# EAGLE schematic rpi_orchids (EAGLE 7.2.0)
A shield for Raspberry pi 3 B: Orchid farm
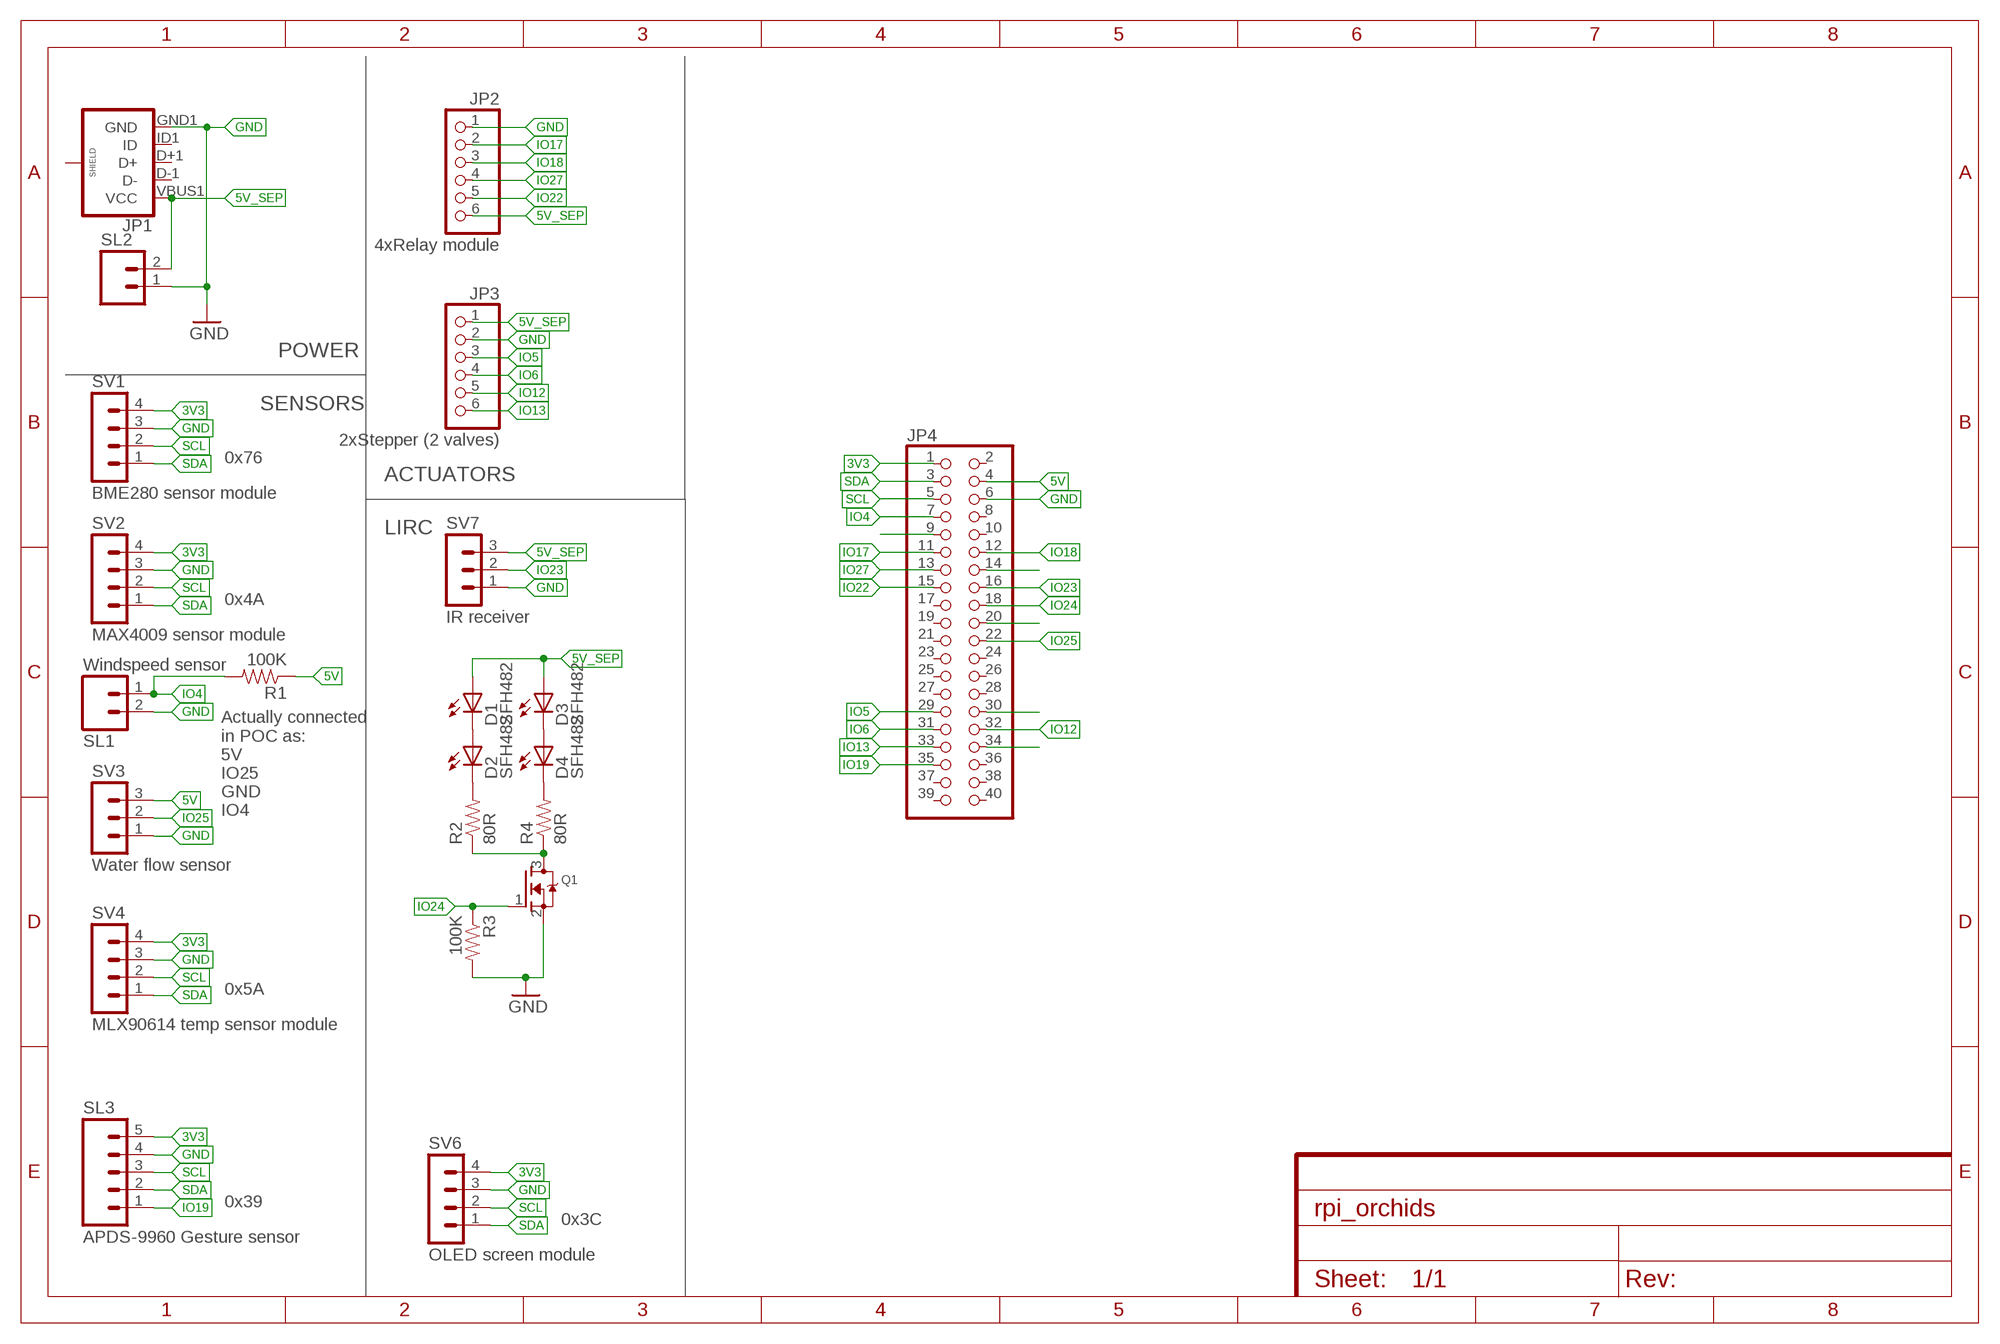
[diagram p0: schematic, sheet 1]

## Parts
D1  SFH482  [SFH482]
D2  SFH482  [SFH482]
D3  SFH482  [SFH482]
D4  SFH482  [SFH482]
JP1  USB_MICROB_PLUGCONN-11752  [USB-B-MICRO-SMD_V03]
JP2  4xRelay module  PINHD-1X6  [1X06]
JP3  2xStepper (2 valves)  PINHD-1X6  [1X06]
JP4  PINHD-2X20  [2X20]
Q1  MOSFET-NREFLOW  [SOT23]
R1  100K  RESISTOR0603  [0603-RES]
R2  80R  RESISTOR0603  [0603-RES]
R3  100K  RESISTOR0603  [0603-RES]
R4  80R  RESISTOR0603  [0603-RES]
SL1  Windspeed sensor  MA02  [02PA]
SL2  MA02  [02PA]
SL3  APDS-9960 Gesture sensor  MA05  [05PA]
SV1  BME280 sensor module  MA04-1  [MA04-1]
SV2  MAX4009 sensor module  MA04-1  [MA04-1]
SV3  Water flow sensor  MA03-1  [MA03-1]
SV4  MLX90614 temp sensor module  MA04-1  [MA04-1]
SV6  OLED screen module  MA04-1  [MA04-1]
SV7  IR receiver  MA03-1  [MA03-1]

## Nets
3V3: JP4.1 SL3.5 SV1.4 SV2.4 SV4.4 SV6.4
5V: JP4.4 R1.1 SV3.3
5V_SEP: D1.A D3.A JP1.VBUS1(VCC) JP2.6 JP3.1 SL2.2 SV7.3
GND: JP1.GND1(GND) JP2.1 JP3.2 JP4.6 Q1.2(S) R3.2 SL1.2 SL2.1 SL3.4 SV1.3 SV2.3 SV3.1 SV4.3 SV6.3 SV7.1
IO4: JP4.7 R1.2 SL1.1
IO5: JP3.3 JP4.29
IO6: JP3.4 JP4.31
IO12: JP3.5 JP4.32
IO13: JP3.6 JP4.33
IO17: JP2.2 JP4.11
IO18: JP2.3 JP4.12
IO19: JP4.35 SL3.1
IO22: JP2.5 JP4.15
IO23: JP4.16 SV7.2
IO24: JP4.18 Q1.1(G) R3.1
IO25: JP4.22 SV3.2
IO27: JP2.4 JP4.13
N$1: D3.K(C) D4.A
N$2: D1.K(C) D2.A
N$3: JP4.30
N$4: D2.K(C) R2.2
N$5: D4.K(C) R4.2
N$6: JP4.34
N$7: JP4.20
N$8: JP4.14
N$9: JP4.9
N$10: Q1.3(D) R2.1 R4.1
SCL: JP4.5 SL3.3 SV1.2 SV2.2 SV4.2 SV6.2
SDA: JP4.3 SL3.2 SV1.1 SV2.1 SV4.1 SV6.1
Unconnected: JP1.D+1(D+) JP1.D-1(D-) JP1.ID1(ID) JP1.SHIELD1(SHIELD) JP1.SHIELD2(SHIELD) JP1.SHIELD3(SHIELD) JP4.2 JP4.8 JP4.10 JP4.17 JP4.19 JP4.21 JP4.23 JP4.24 JP4.25 JP4.26 JP4.27 JP4.28 JP4.36 JP4.37 JP4.38 JP4.39 JP4.40

## Notes on the sheet
- POWER
- SENSORS
- 0x76
- ACTUATORS
- LIRC
- 0x4A
- Actually connected
  in POC as:
  5V
  IO25
  GND
  IO4
- 0x5A
- 0x39
- 0x3C

## Library data of the parts
D1-D4 = led:SFH482: IR LED infrared emitting diode, Infineon
JP1 = SparkFun-Connectors:USB_MICROB_PLUG: USB Micro-B connectors Some male, some female. Watch your step!; PROD_ID: CONN-11752
JP2 JP3 = pinhead:PINHD-1X6: PIN HEADER
JP4 = adafruit:PINHD-2X20: PIN HEADER
Q1 = adafruit:MOSFET-N: N-Channel Mosfet 2N7002E - 60V 260mA SOT23 [Digikey: 2N7002ET1GOSTR-ND] - REEL BSH103 - 30V 850mA SOT23 [Digikey: 568-5013-1-ND]
R1-R4 = SparkFun-Resistors:RESISTOR: Resistor Basic schematic elements and footprints for 0603, 1206, and PTH resistors.
SL1 SL2 = con-amp-quick:MA02: AMP QUICK CONNECTOR; OC_FARNELL: unknown; OC_NEWARK: unknown
SL3 = con-amp-quick:MA05: AMP QUICK CONNECTOR; OC_FARNELL: unknown; OC_NEWARK: unknown
SV1 SV2 SV4 SV6 = con-lstb:MA04-1: PIN HEADER; OC_FARNELL: unknown; OC_NEWARK: unknown
SV3 SV7 = con-lstb:MA03-1: PIN HEADER; OC_FARNELL: unknown; OC_NEWARK: unknown